# Altium schematic sheet NUC973.SchDoc
size 320 x 240 mm
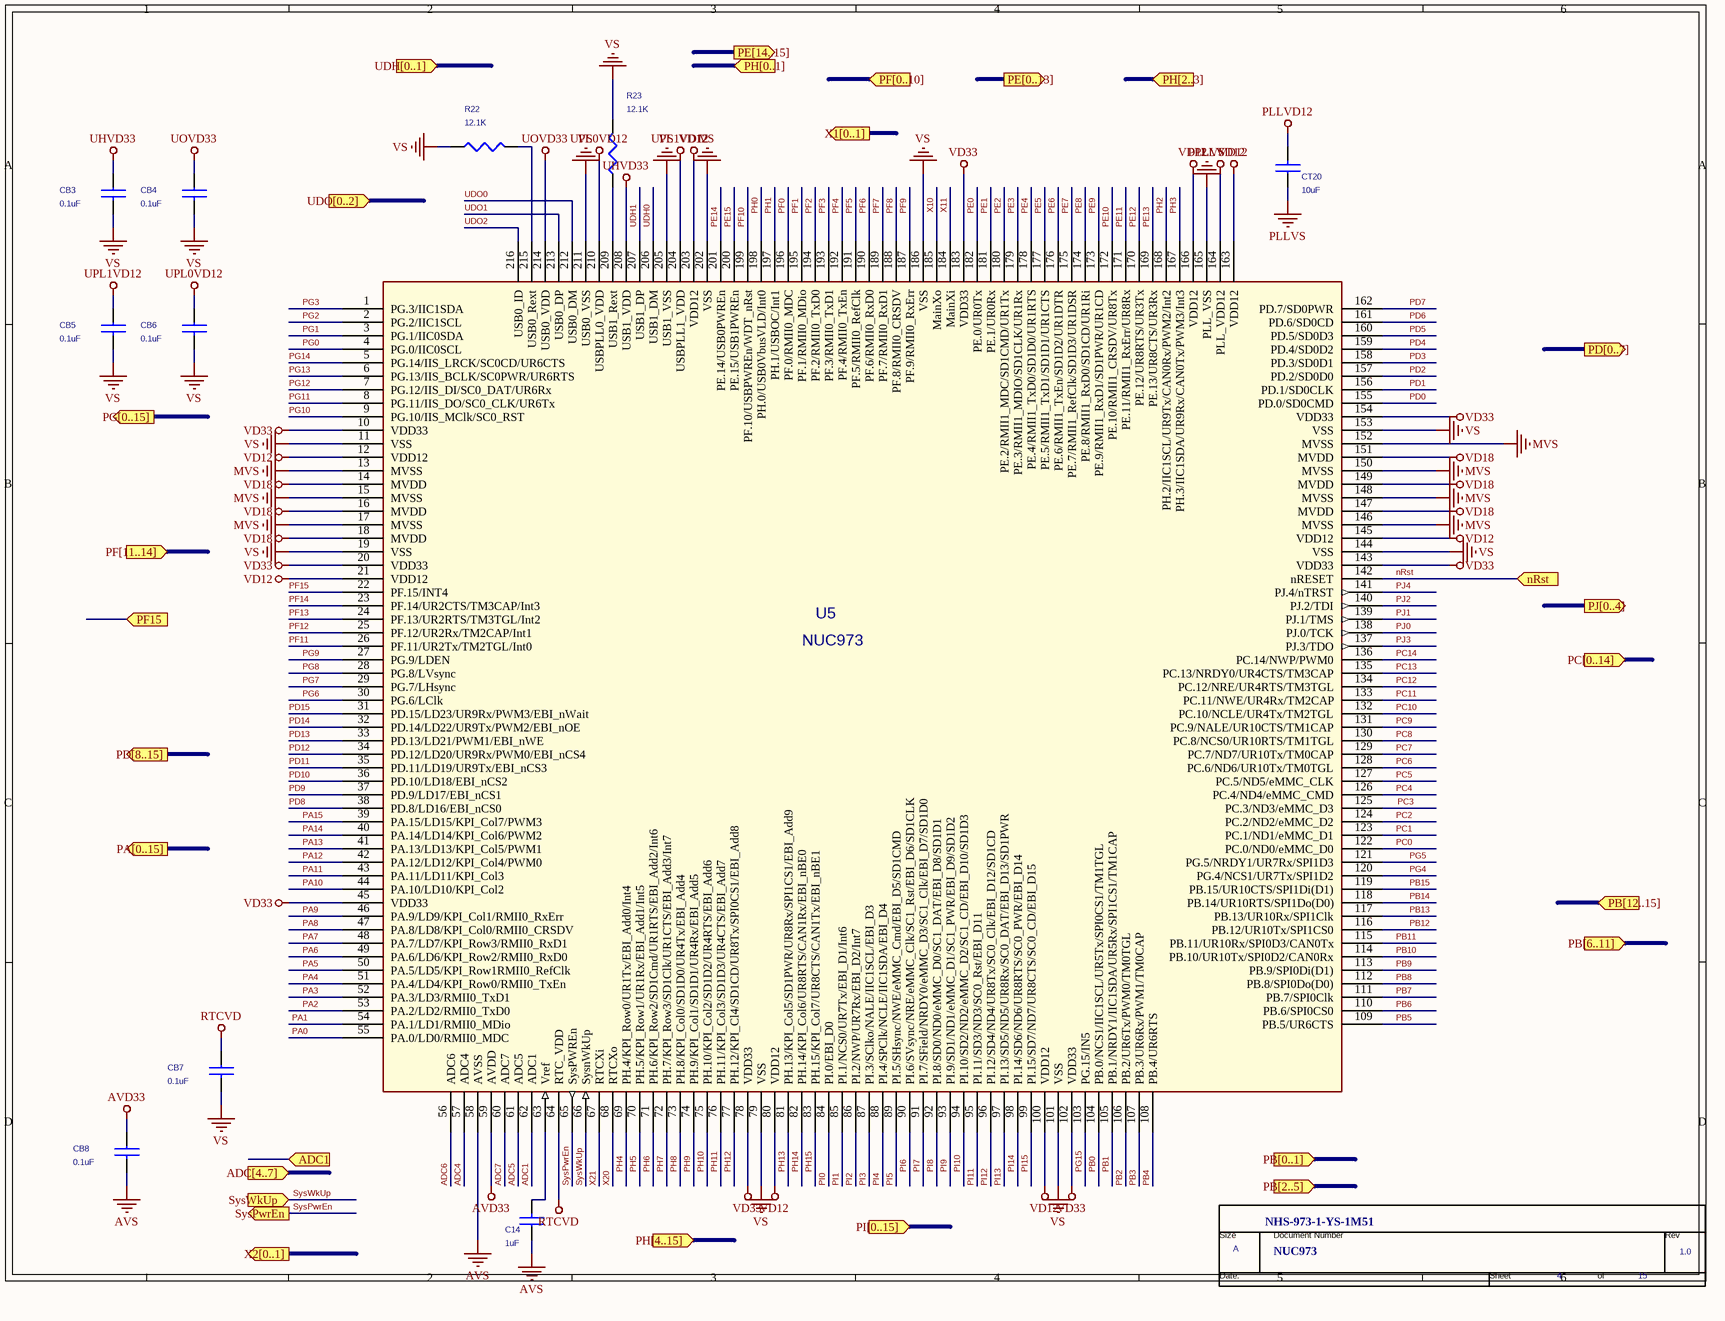
[diagram p0: NUC973.SchDoc]

## Parts
*  RevCode: 1.0  Page Size: A  Page Number: 4  Page Count: 15  Doc: NUC973  OrgName: NHS-973-1-YS-1M51  (hidden comment: TitleBlock0N)  (graphical)
C14  1uF  [C0603]
CB3  0.1uF  [C0603]
CB4  0.1uF  [C0603]
CB5  0.1uF  [C0603]
CB6  0.1uF  [C0603]
CB7  0.1uF  [C0603]
CB8  0.1uF  [C0603]
CT20  10uF  [C0603]
R22  12.1K  [R0603]
R23  12.1K  [R0603]
U5  NUC973  [LQFP-216]

## Ports
ADC1 (in), ADC[4..7] (in), nRst (in), PA[0..15] (out), PB[0..1] (in), PB[2..5] (in), PB[6..11] (in), PB[12..15] (in), PC[0..14] (in), PD[0..7] (out), PD[8..15] (out), PE[0..13] (out), PE[14..15] (out), PF15 (in), PF[0..10] (in), PF[11..14] (in), PG[0..15] (out), PH[0..1] (in), PH[2..3] (in), PH[4..15] (in), PI[0..15] (in), PJ[0..4] (out), SysPwrEn (out), SysWkUp (in), UDH[0..1] (in), UDO[0..2] (in), X1[0..1] (out), X2[0..1] (out)

## Nets
AVD33: CB8.1 U5.59(AVDD)
AVS: C14.1 CB8.2 U5.58(AVSS)
MVS: U5.13(MVSS) U5.15(MVSS) U5.17(MVSS) U5.146(MVSS) U5.148(MVSS) U5.150(MVSS) U5.152(MVSS)
PLLVD12: CT20.2 U5.164(PLL_VDD12)
PLLVS: CT20.1 U5.165(PLL_VSS)
RTCVD: CB7.1 U5.64(RTC_VDD)
UHVD33: CB3.1 U5.208(USB1_VDD)
UOVD33: CB4.1 U5.214(USB0_VDD)
UPL0VD12: CB6.1 U5.210(USBPLL0_VDD)
UPL1VD12: CB5.1 U5.204(USBPLL1_VDD)
VD12: U5.12(VDD12) U5.21(VDD12) U5.80(VDD12) U5.100(VDD12) U5.145(VDD12) U5.163(VDD12) U5.166(VDD12) U5.203(VDD12)
VD18: U5.14(MVDD) U5.16(MVDD) U5.18(MVDD) U5.147(MVDD) U5.149(MVDD) U5.151(MVDD)
VD33: U5.10(VDD33) U5.20(VDD33) U5.45(VDD33) U5.78(VDD33) U5.102(VDD33) U5.143(VDD33) U5.154(VDD33) U5.183(VDD33)
VS: CB3.2 CB4.2 CB5.2 CB6.2 CB7.2 R22.2 R23.2 U5.11(VSS) U5.19(VSS) U5.79(VSS) U5.101(VSS) U5.144(VSS) U5.153(VSS) U5.186(VSS) U5.202(VSS) U5.205(USB1_VSS) U5.211(USB0_VSS)
ADC1: U5.62(ADC1)
ADC4: U5.57(ADC4)
ADC5: U5.61(ADC5)
ADC6: U5.56(ADC6)
ADC7: U5.60(ADC7)
nRst: U5.142(nRESET) ; port nRst
PA0: U5.55(PA.0/LD0/RMII0_MDC)
PA1: U5.54(PA.1/LD1/RMII0_MDio)
PA2: U5.53(PA.2/LD2/RMII0_TxD0)
PA3: U5.52(PA.3/LD3/RMII0_TxD1)
PA4: U5.51(PA.4/LD4/KPI_Row0/RMII0_TxEn)
PA5: U5.50(PA.5/LD5/KPI_Row1RMII0_RefClk)
PA6: U5.49(PA.6/LD6/KPI_Row2/RMII0_RxD0)
PA7: U5.48(PA.7/LD7/KPI_Row3/RMII0_RxD1)
PA8: U5.47(PA.8/LD8/KPI_Col0/RMII0_CRSDV)
PA9: U5.46(PA.9/LD9/KPI_Col1/RMII0_RxErr)
PA10: U5.44(PA.10/LD10/KPI_Col2)
PA11: U5.43(PA.11/LD11/KPI_Col3)
PA12: U5.42(PA.12/LD12/KPI_Col4/PWM0)
PA13: U5.41(PA.13/LD13/KPI_Col5/PWM1)
PA14: U5.40(PA.14/LD14/KPI_Col6/PWM2)
PA15: U5.39(PA.15/LD15/KPI_Col7/PWM3)
PB0: U5.104(PB.0/NCS1/IIC1SCL/UR5Tx/SPI0CS1/TM1TGL)
PB1: U5.105(PB.1/NRDY1/IIC1SDA/UR5Rx/SPI1CS1/TM1CAP)
PB2: U5.106(PB.2/UR6Tx/PWM0/TM0TGL)
PB3: U5.107(PB.3/UR6Rx/PWM1/TM0CAP)
PB4: U5.108(PB.4/UR6RTS)
PB5: U5.109(PB.5/UR6CTS)
PB6: U5.110(PB.6/SPI0CS0)
PB7: U5.111(PB.7/SPI0Clk)
PB8: U5.112(PB.8/SPI0Do(D0))
PB9: U5.113(PB.9/SPI0Di(D1))
PB10: U5.114(PB.10/UR10Tx/SPI0D2/CAN0Rx)
PB11: U5.115(PB.11/UR10Rx/SPI0D3/CAN0Tx)
PB12: U5.116(PB.12/UR10Tx/SPI1CS0)
PB13: U5.117(PB.13/UR10Rx/SPI1Clk)
PB14: U5.118(PB.14/UR10RTS/SPI1Do(D0))
PB15: U5.119(PB.15/UR10CTS/SPI1Di(D1))
PC0: U5.122(PC.0/ND0/eMMC_D0)
PC1: U5.123(PC.1/ND1/eMMC_D1)
PC2: U5.124(PC.2/ND2/eMMC_D2)
PC3: U5.125(PC.3/ND3/eMMC_D3)
PC4: U5.126(PC.4/ND4/eMMC_CMD)
PC5: U5.127(PC.5/ND5/eMMC_CLK)
PC6: U5.128(PC.6/ND6/UR10Tx/TM0TGL)
PC7: U5.129(PC.7/ND7/UR10Tx/TM0CAP)
PC8: U5.130(PC.8/NCS0/UR10RTS/TM1TGL)
PC9: U5.131(PC.9/NALE/UR10CTS/TM1CAP)
PC10: U5.132(PC.10/NCLE/UR4Tx/TM2TGL)
PC11: U5.133(PC.11/NWE/UR4Rx/TM2CAP)
PC12: U5.134(PC.12/NRE/UR4RTS/TM3TGL)
PC13: U5.135(PC.13/NRDY0/UR4CTS/TM3CAP)
PC14: U5.136(PC.14/NWP/PWM0)
PD0: U5.155(PD.0/SD0CMD)
PD1: U5.156(PD.1/SD0CLK)
PD2: U5.157(PD.2/SD0D0)
PD3: U5.158(PD.3/SD0D1)
PD4: U5.159(PD.4/SD0D2)
PD5: U5.160(PD.5/SD0D3)
PD6: U5.161(PD.6/SD0CD)
PD7: U5.162(PD.7/SD0PWR)
PD8: U5.38(PD.8/LD16/EBI_nCS0)
PD9: U5.37(PD.9/LD17/EBI_nCS1)
PD10: U5.36(PD.10/LD18/EBI_nCS2)
PD11: U5.35(PD.11/LD19/UR9Tx/EBI_nCS3)
PD12: U5.34(PD.12/LD20/UR9Rx/PWM0/EBI_nCS4)
PD13: U5.33(PD.13/LD21/PWM1/EBI_nWE)
PD14: U5.32(PD.14/LD22/UR9Tx/PWM2/EBI_nOE)
PD15: U5.31(PD.15/LD23/UR9Rx/PWM3/EBI_nWait)
PE0: U5.182(PE.0/UR0Tx)
PE1: U5.181(PE.1/UR0Rx)
PE2: U5.180(PE.2/RMII1_MDC/SD1CMD/UR1Tx)
PE3: U5.179(PE.3/RMII1_MDIO/SD1CLK/UR1Rx)
PE4: U5.178(PE.4/RMII1_TxD0/SD1D0/UR1RTS)
PE5: U5.177(PE.5/RMII1_TxD1/SD1D1/UR1CTS)
PE6: U5.176(PE.6/RMII1_TxEn/SD1D2/UR1DTR)
PE7: U5.175(PE.7/RMII1_RefClk/SD1D3/UR1DSR)
PE8: U5.174(PE.8/RMII1_RxD0/SD1CD/UR1Ri)
PE9: U5.173(PE.9/RMII1_RxD1/SD1PWR/UR1CD)
PE10: U5.172(PE.10/RMII1_CRSDV/UR8Tx)
PE11: U5.171(PE.11/RMII1_RxErr/UR8Rx)
PE12: U5.170(PE.12/UR8RTS/UR3Tx)
PE13: U5.169(PE.13/UR8CTS/UR3Rx)
PE14: U5.201(PE.14/USB0PWREn)
PE15: U5.200(PE.15/USB1PWREn)
PF0: U5.196(PF.0/RMII0_MDC)
PF1: U5.195(PF.1/RMII0_MDio)
PF2: U5.194(PF.2/RMII0_TxD0)
PF3: U5.193(PF.3/RMII0_TxD1)
PF4: U5.192(PF.4/RMII0_TxEn)
PF5: U5.191(PF.5/RMII0_RefClk)
PF6: U5.190(PF.6/RMII0_RxD0)
PF7: U5.189(PF.7/RMII0_RxD1)
PF8: U5.188(PF.8/RMII0_CRSDV)
PF9: U5.187(PF.9/RMII0_RxErr)
PF10: U5.199(PF.10/USBPWREn/WDT_nRst)
PF11: U5.26(PF.11/UR2Tx/TM2TGL/Int0)
PF12: U5.25(PF.12/UR2Rx/TM2CAP/Int1)
PF13: U5.24(PF.13/UR2RTS/TM3TGL/Int2)
PF14: U5.23(PF.14/UR2CTS/TM3CAP/Int3)
PF15: U5.22(PF.15/INT4)
PG0: U5.4(PG.0/IIC0SCL)
PG1: U5.3(PG.1/IIC0SDA)
PG2: U5.2(PG.2/IIC1SCL)
PG3: U5.1(PG.3/IIC1SDA)
PG4: U5.120(PG.4/NCS1/UR7Tx/SPI1D2)
PG5: U5.121(PG.5/NRDY1/UR7Rx/SPI1D3)
PG6: U5.30(PG.6/LClk)
PG7: U5.29(PG.7/LHsync)
PG8: U5.28(PG.8/LVsync)
PG9: U5.27(PG.9/LDEN)
PG10: U5.9(PG.10/IIS_MClk/SC0_RST)
PG11: U5.8(PG.11/IIS_DO/SC0_CLK/UR6Tx)
PG12: U5.7(PG.12/IIS_DI/SC0_DAT/UR6Rx)
PG13: U5.6(PG.13/IIS_BCLK/SC0PWR/UR6RTS)
PG14: U5.5(PG.14/IIS_LRCK/SC0CD/UR6CTS)
PG15: U5.103(PG.15/IN5)
PH0: U5.198(PH.0/USB0VbusVLD/Int0)
PH1: U5.197(PH.1/USBOC/Int1)
PH2: U5.168(PH.2/IIC1SCL/UR9Tx/CAN0Rx/PWM2/Int2)
PH3: U5.167(PH.3/IIC1SDA/UR9Rx/CAN0Tx/PWM3/Int3)
PH4: U5.69(PH.4/KPI_Row0/UR1Tx/EBI_Add0/Int4)
PH5: U5.70(PH.5/KPI_Row1/UR1Rx/EBI_Add1/Int5)
PH6: U5.71(PH.6/KPI_Row2/SD1Cmd/UR1RTS/EBI_Add2/Int6)
PH7: U5.72(PH.7/KPI_Row3/SD1Clk/UR1CTS/EBI_Add3/Int7)
PH8: U5.73(PH.8/KPI_Col0/SD1D0/UR4Tx/EBI_Add4)
PH9: U5.74(PH.9/KPI_Col1/SD1D1/UR4Rx/EBI_Add5)
PH10: U5.75(PH.10/KPI_Col2/SD1D2/UR4RTS/EBI_Add6)
PH11: U5.76(PH.11/KPI_Col3/SD1D3/UR4CTS/EBI_Add7)
PH12: U5.77(PH.12/KPI_Cl4/SD1CD/UR8Tx/SPI0CS1/EBI_Add8)
PH13: U5.81(PH.13/KPI_Col5/SD1PWR/UR8Rx/SPI1CS1/EBI_Add9)
PH14: U5.82(PH.14/KPI_Col6/UR8RTS/CAN1Rx/EBI_nBE0)
PH15: U5.83(PH.15/KPI_Col7/UR8CTS/CAN1Tx/EBI_nBE1)
PI0: U5.84(PI.0/EBI_D0)
PI1: U5.85(PI.1/NCS0/UR7Tx/EBI_D1/Int6)
PI2: U5.86(PI.2/NWP/UR7Rx/EBI_D2/Int7)
PI3: U5.87(PI.3/SClko/NALE/IIC1SCL/EBI_D3)
PI4: U5.88(PI.4/SPClk/NCLE/IIC1SDA/EBI_D4)
PI5: U5.89(PI.5/SHsync/NWE/eMMC_Cmd/EBI_D5/SD1CMD)
PI6: U5.90(PI.6/SVsync/NRE/eMMC_Clk/SC1_Rst/EBI_D6/SD1CLK)
PI7: U5.91(PI.7/SField/NRDY0/eMMC_D3/SC1_Clk/EBI_D7/SD1D0)
PI8: U5.92(PI.8/SD0/ND0/eMMC_D0/SC1_DAT/EBI_D8/SD1D1)
PI9: U5.93(PI.9/SD1/ND1/eMMC_D1/SC1_PWR/EBI_D9/SD1D2)
PI10: U5.94(PI.10/SD2/ND2/eMMC_D2/SC1_CD/EBI_D10/SD1D3)
PI11: U5.95(PI.11/SD3/ND3/SC0_Rst/EBI_D11)
PI12: U5.96(PI.12/SD4/ND4/UR8Tx/SC0_Clk/EBI_D12/SD1CD)
PI13: U5.97(PI.13/SD5/ND5/UR8Rx/SC0_DAT/EBI_D13/SD1PWR)
PI14: U5.98(PI.14/SD6/ND6/UR8RTS/SC0_PWR/EBI_D14)
PI15: U5.99(PI.15/SD7/ND7/UR8CTS/SC0_CD/EBI_D15)
PJ0: U5.138(PJ.0/TCK)
PJ1: U5.139(PJ.1/TMS)
PJ2: U5.140(PJ.2/TDI)
PJ3: U5.137(PJ.3/TDO)
PJ4: U5.141(PJ.4/nTRST)
SysPwrEn: U5.65(SysPWREn) ; port SysPwrEn
SysWkUp: U5.66(SysnWkUp) ; port SysWkUp
UDH0: U5.206(USB1_DM)
UDH1: U5.207(USB1_DP)
UDO0: U5.212(USB0_DM)
UDO1: U5.213(USB0_DP)
UDO2: U5.216(USB0_ID)
X10: U5.185(MainXo)
X11: U5.184(MainXi)
X20: U5.68(RTCXo)
X21: U5.67(RTCXi)
NetC14_2: C14.2 U5.63(Vref)
NetR22_1: R22.1 U5.215(USB0_Rext)
NetR23_1: R23.1 U5.209(USB1_Rext)

## Notes on the sheet
- (in symbol TitleBlock0N) Size; Document Number; Rev; Date:; Sheet; of

## Library data of the parts
C14 CB3-CB8 CT20 = CAP NP
R22 R23 = R
U5 = NUC973_6
* = TitleBlock0N: Page Create Date: April 25, 1995